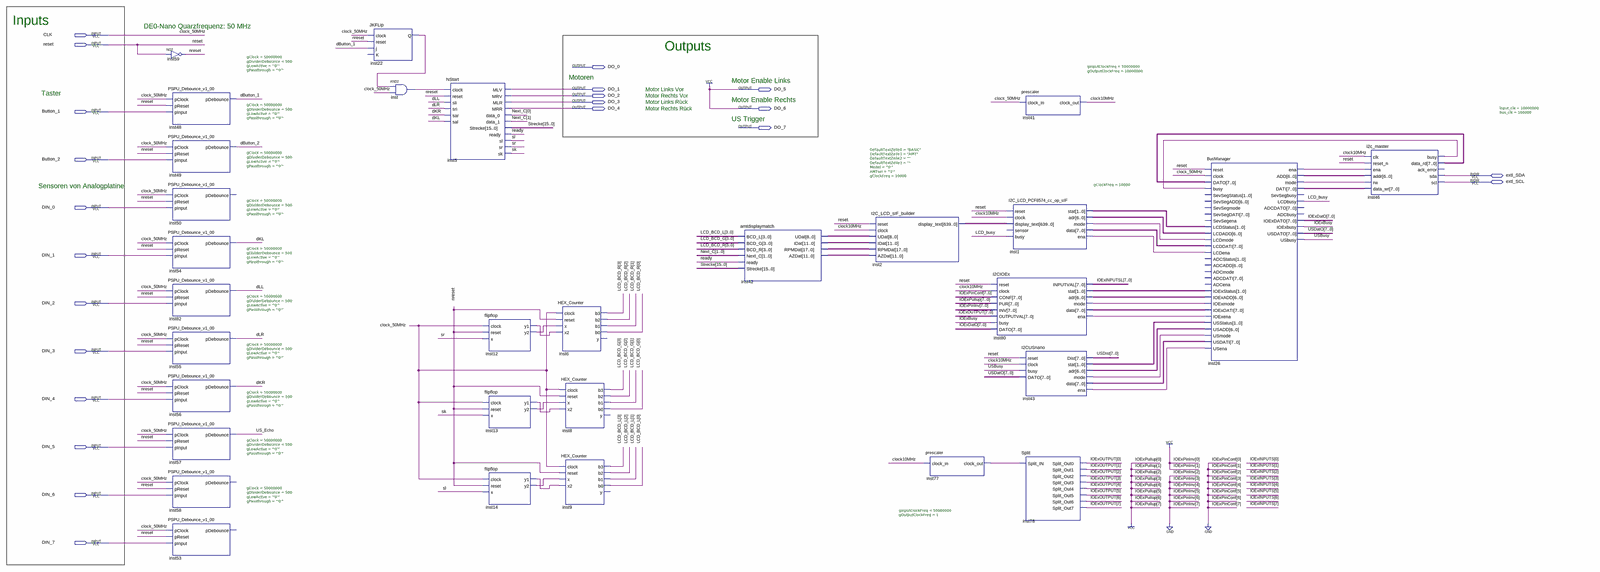
[diagram p0: schematic sheet, whole]
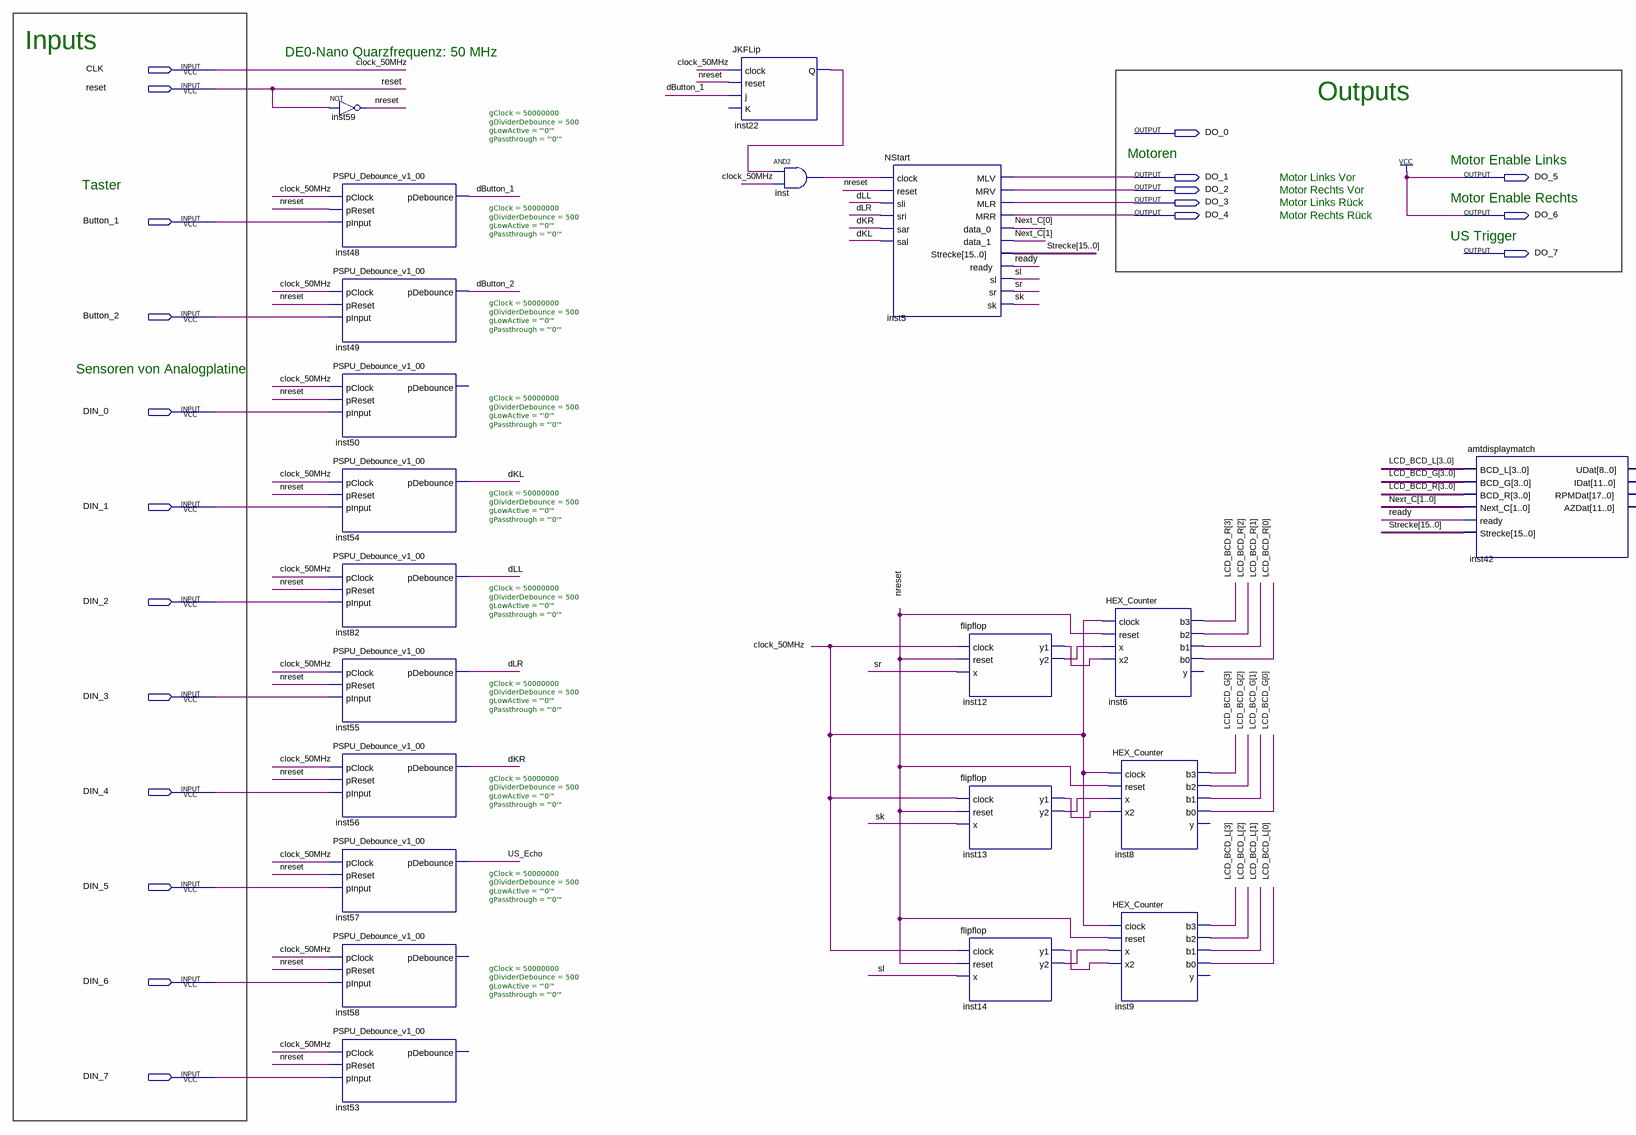
[diagram p1: schematic sheet, left part]
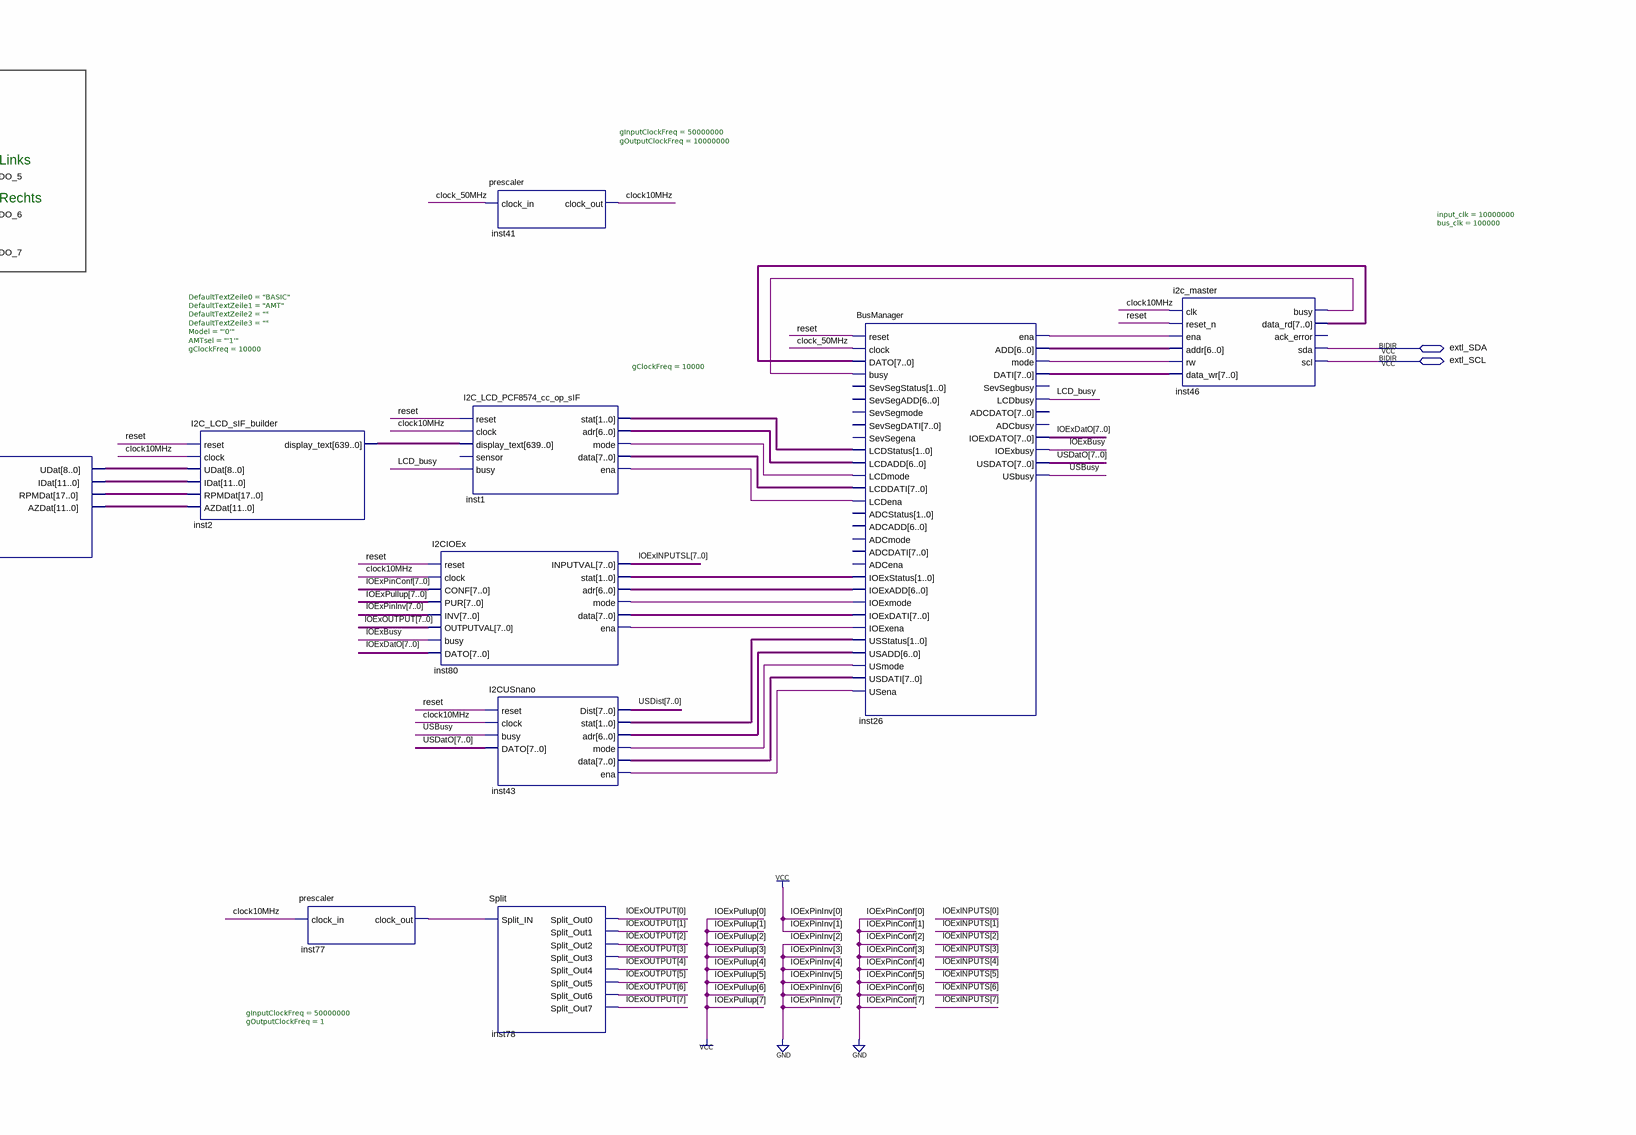
[diagram p2: schematic sheet, right part]
// Quartus schematic AMT.bdf as structural Verilog: 30 symbols, 22 pins
module AMT (
  input  CLK,
  input  reset,
  input  Button_1,
  input  Button_2,
  input  DIN_0,
  input  DIN_1,
  input  DIN_2,
  input  DIN_3,
  input  DIN_4,
  input  DIN_5,
  input  DIN_6,
  input  DIN_7,
  inout  extl_SDA,
  inout  extl_SCL,
  output DO_0,
  output DO_1,
  output DO_5,
  output DO_2,
  output DO_3,
  output DO_4,
  output DO_6,
  output DO_7
);

  wire clock10MHz, dButton_1, dButton_2, dKL, dKR, dLL, dLR, inst1_ena, inst1_mode, inst12_y1, inst12_y2,
       inst13_y1, inst13_y2, inst14_y1, inst14_y2, inst22_q, inst26_ena, inst26_mode, inst43_ena,
       inst43_mode, inst46_busy, inst77_clock_out, inst80_ena, inst80_mode, inst_out, IOExBusy, LCD_busy,
       nreset, ready, sk, sl, sr, US_Echo, USBusy;
  wire [1:0] inst1_stat, inst43_stat, inst80_stat, Next_C;
  wire [3:0] LCD_BCD_G, LCD_BCD_L, LCD_BCD_R;
  wire [6:0] inst1_adr, inst26_add, inst43_adr, inst80_adr;
  wire [7:0] inst1_data, inst26_dati, inst43_data, inst46_data_rd, inst80_data, IOExDatO, IOExINPUTSL,
       IOExOUTPUT, USDatO, USDist;
  wire [8:0] inst42_udat;
  wire [11:0] inst42_azdat, inst42_idat;
  wire [15:0] Strecke;
  wire [17:0] inst42_rpmdat;
  wire [639:0] inst2_display_text;

  not inst59 (nreset, reset);
  PSPU_Debounce_v1_00 #(.gClock(50000000), .gDividerDebounce(500), .gLowActive("'0'"), .gPassthrough("'0'")) inst48 (
    .pClock(CLK), .pReset(nreset), .pInput(Button_1), .pDebounce(dButton_1));
  PSPU_Debounce_v1_00 #(.gClock(50000000), .gDividerDebounce(500), .gLowActive("'0'"), .gPassthrough("'0'")) inst49 (
    .pClock(CLK), .pReset(nreset), .pInput(Button_2), .pDebounce(dButton_2));
  PSPU_Debounce_v1_00 #(.gClock(50000000), .gDividerDebounce(500), .gLowActive("'0'"), .gPassthrough("'0'")) inst50 (
    .pClock(CLK), .pReset(nreset), .pInput(DIN_0));  // open: pDebounce
  PSPU_Debounce_v1_00 #(.gClock(50000000), .gDividerDebounce(500), .gLowActive("'0'"), .gPassthrough("'0'")) inst54 (
    .pClock(CLK), .pReset(nreset), .pInput(DIN_1), .pDebounce(dKL));
  PSPU_Debounce_v1_00 #(.gClock(50000000), .gDividerDebounce(500), .gLowActive("'0'"), .gPassthrough("'0'")) inst82 (
    .pClock(CLK), .pReset(nreset), .pInput(DIN_2), .pDebounce(dLL));
  PSPU_Debounce_v1_00 #(.gClock(50000000), .gDividerDebounce(500), .gLowActive("'0'"), .gPassthrough("'0'")) inst55 (
    .pClock(CLK), .pReset(nreset), .pInput(DIN_3), .pDebounce(dLR));
  PSPU_Debounce_v1_00 #(.gClock(50000000), .gDividerDebounce(500), .gLowActive("'0'"), .gPassthrough("'0'")) inst56 (
    .pClock(CLK), .pReset(nreset), .pInput(DIN_4), .pDebounce(dKR));
  PSPU_Debounce_v1_00 #(.gClock(50000000), .gDividerDebounce(500), .gLowActive("'0'"), .gPassthrough("'0'")) inst57 (
    .pClock(CLK), .pReset(nreset), .pInput(DIN_5), .pDebounce(US_Echo));
  PSPU_Debounce_v1_00 #(.gClock(50000000), .gDividerDebounce(500), .gLowActive("'0'"), .gPassthrough("'0'")) inst58 (
    .pClock(CLK), .pReset(nreset), .pInput(DIN_6));  // open: pDebounce
  PSPU_Debounce_v1_00 #(.gClock(50000000), .gDividerDebounce(500), .gLowActive("'0'"), .gPassthrough("'0'")) inst53 (
    .pClock(CLK), .pReset(nreset), .pInput(DIN_7));  // open: pDebounce
  JKFLip inst22 (.clock(CLK), .reset(nreset), .j(dButton_1), .Q(inst22_q));  // open: K
  and inst (inst_out, inst22_q, CLK);
  NStart inst5 (
    .clock(inst_out), .reset(nreset), .sli(dLL), .sri(dLR), .sar(dKR), .sal(dKL), .MLV(DO_1), .MRV(DO_2),
    .MLR(DO_3), .MRR(DO_4), .data_0(Next_C[0]), .data_1(Next_C[1]), .Strecke(Strecke), .ready(ready),
    .sl(sl), .sr(sr), .sk(sk));
  flipflop inst12 (.clock(CLK), .reset(nreset), .x(sr), .y1(inst12_y1), .y2(inst12_y2));
  flipflop inst13 (.clock(CLK), .reset(nreset), .x(sk), .y1(inst13_y1), .y2(inst13_y2));
  flipflop inst14 (.clock(CLK), .reset(nreset), .x(sl), .y1(inst14_y1), .y2(inst14_y2));
  HEX_Counter inst6 (
    .clock(CLK), .reset(nreset), .x(inst12_y2), .x2(inst12_y1), .b3(LCD_BCD_R[3]), .b2(LCD_BCD_R[2]),
    .b1(LCD_BCD_R[1]), .b0(LCD_BCD_R[0]));  // open: y
  HEX_Counter inst8 (
    .clock(CLK), .reset(nreset), .x(inst13_y2), .x2(inst13_y1), .b3(LCD_BCD_G[3]), .b2(LCD_BCD_G[2]),
    .b1(LCD_BCD_G[1]), .b0(LCD_BCD_G[0]));  // open: y
  HEX_Counter inst9 (
    .clock(CLK), .reset(nreset), .x(inst14_y2), .x2(inst14_y1), .b3(LCD_BCD_L[3]), .b2(LCD_BCD_L[2]),
    .b1(LCD_BCD_L[1]), .b0(LCD_BCD_L[0]));  // open: y
  amtdisplaymatch inst42 (
    .BCD_L(LCD_BCD_L), .BCD_G(LCD_BCD_G), .BCD_R(LCD_BCD_R), .Next_C(Next_C), .ready(ready),
    .Strecke(Strecke), .UDat(inst42_udat), .IDat(inst42_idat), .RPMDat(inst42_rpmdat), .AZDat(inst42_azdat));
  I2C_LCD_sIF_builder #(.DefaultTextZeile0("BASIC"), .DefaultTextZeile1("AMT"), .DefaultTextZeile2(""), .DefaultTextZeile3(""), .Model("'0'"), .AMTsel("'1'"), .gClockFreq(10000)) inst2 (
    .reset(reset), .clock(clock10MHz), .UDat(inst42_udat), .IDat(inst42_idat), .RPMDat(inst42_rpmdat),
    .AZDat(inst42_azdat), .display_text(inst2_display_text));
  prescaler #(.gInputClockFreq(50000000), .gOutputClockFreq(1)) inst77 (
    .clock_in(clock10MHz), .clock_out(inst77_clock_out));
  I2CIOEx inst80 (
    .reset(reset), .clock(clock10MHz), .CONF({8{1'b0}}), .PUR({8{1'b1}}), .INV(8'b00000011),
    .OUTPUTVAL(IOExOUTPUT), .busy(IOExBusy), .DATO(IOExDatO), .INPUTVAL(IOExINPUTSL), .stat(inst80_stat),
    .adr(inst80_adr), .mode(inst80_mode), .data(inst80_data), .ena(inst80_ena));
  prescaler #(.gInputClockFreq(50000000), .gOutputClockFreq(10000000)) inst41 (.clock_in(CLK), .clock_out(clock10MHz));
  I2C_LCD_PCF8574_cc_op_sIF #(.gClockFreq(10000)) inst1 (
    .reset(reset), .clock(clock10MHz), .display_text(inst2_display_text), .busy(LCD_busy), .stat(inst1_stat),
    .adr(inst1_adr), .mode(inst1_mode), .data(inst1_data), .ena(inst1_ena));  // open: sensor
  I2CUSnano inst43 (
    .reset(reset), .clock(clock10MHz), .busy(USBusy), .DATO(USDatO), .Dist(USDist), .stat(inst43_stat),
    .adr(inst43_adr), .mode(inst43_mode), .data(inst43_data), .ena(inst43_ena));
  Split inst78 (
    .Split_IN(inst77_clock_out), .Split_Out0(IOExOUTPUT[0]), .Split_Out1(IOExOUTPUT[1]),
    .Split_Out2(IOExOUTPUT[2]), .Split_Out3(IOExOUTPUT[3]), .Split_Out4(IOExOUTPUT[4]),
    .Split_Out5(IOExOUTPUT[5]), .Split_Out6(IOExOUTPUT[6]), .Split_Out7(IOExOUTPUT[7]));
  BusManager inst26 (
    .reset(reset), .clock(CLK), .DATO(inst46_data_rd), .busy(inst46_busy), .LCDStatus(inst1_stat),
    .LCDADD(inst1_adr), .LCDmode(inst1_mode), .LCDDATI(inst1_data), .LCDena(inst1_ena),
    .IOExStatus(inst80_stat), .IOExADD(inst80_adr), .IOExmode(inst80_mode), .IOExDATI(inst80_data),
    .IOExena(inst80_ena), .USStatus(inst43_stat), .USADD(inst43_adr), .USmode(inst43_mode),
    .USDATI(inst43_data), .USena(inst43_ena), .ena(inst26_ena), .ADD(inst26_add), .mode(inst26_mode),
    .DATI(inst26_dati), .LCDbusy(LCD_busy), .IOExDATO(IOExDatO), .IOExbusy(IOExBusy), .USDATO(USDatO),
    .USbusy(USBusy));  // open: SevSegStatus, SevSegADD, SevSegmode, SevSegDATI, SevSegena, ADCStatus, ADCADD, ADCmode, ADCDATI, ADCena, SevSegbusy, ADCDATO, ADCbusy
  i2c_master #(.input_clk(10000000), .bus_clk(100000)) inst46 (
    .clk(clock10MHz), .reset_n(reset), .ena(inst26_ena), .addr(inst26_add), .rw(inst26_mode),
    .data_wr(inst26_dati), .busy(inst46_busy), .data_rd(inst46_data_rd), .sda(extl_SDA), .scl(extl_SCL));  // open: ack_error

  assign DO_5 = 1'b1;
  assign DO_6 = 1'b1;

  // Other names for the same wires on the sheet: clock_50MHz = CLK

  // Notes on the sheet:
  //   Inputs
  //   DE0-Nano Quarzfrequenz: 50 MHz
  //   Outputs
  //   Motoren
  //   Motor Enable Links
  //   Motor Links Vor
  //   Taster
  //   Motor Rechts Vor
  //   Motor Enable Rechts
  //   Motor Links Rück
  //   Motor Rechts Rück
  //   US Trigger
  //   Sensoren von Analogplatine
endmodule
